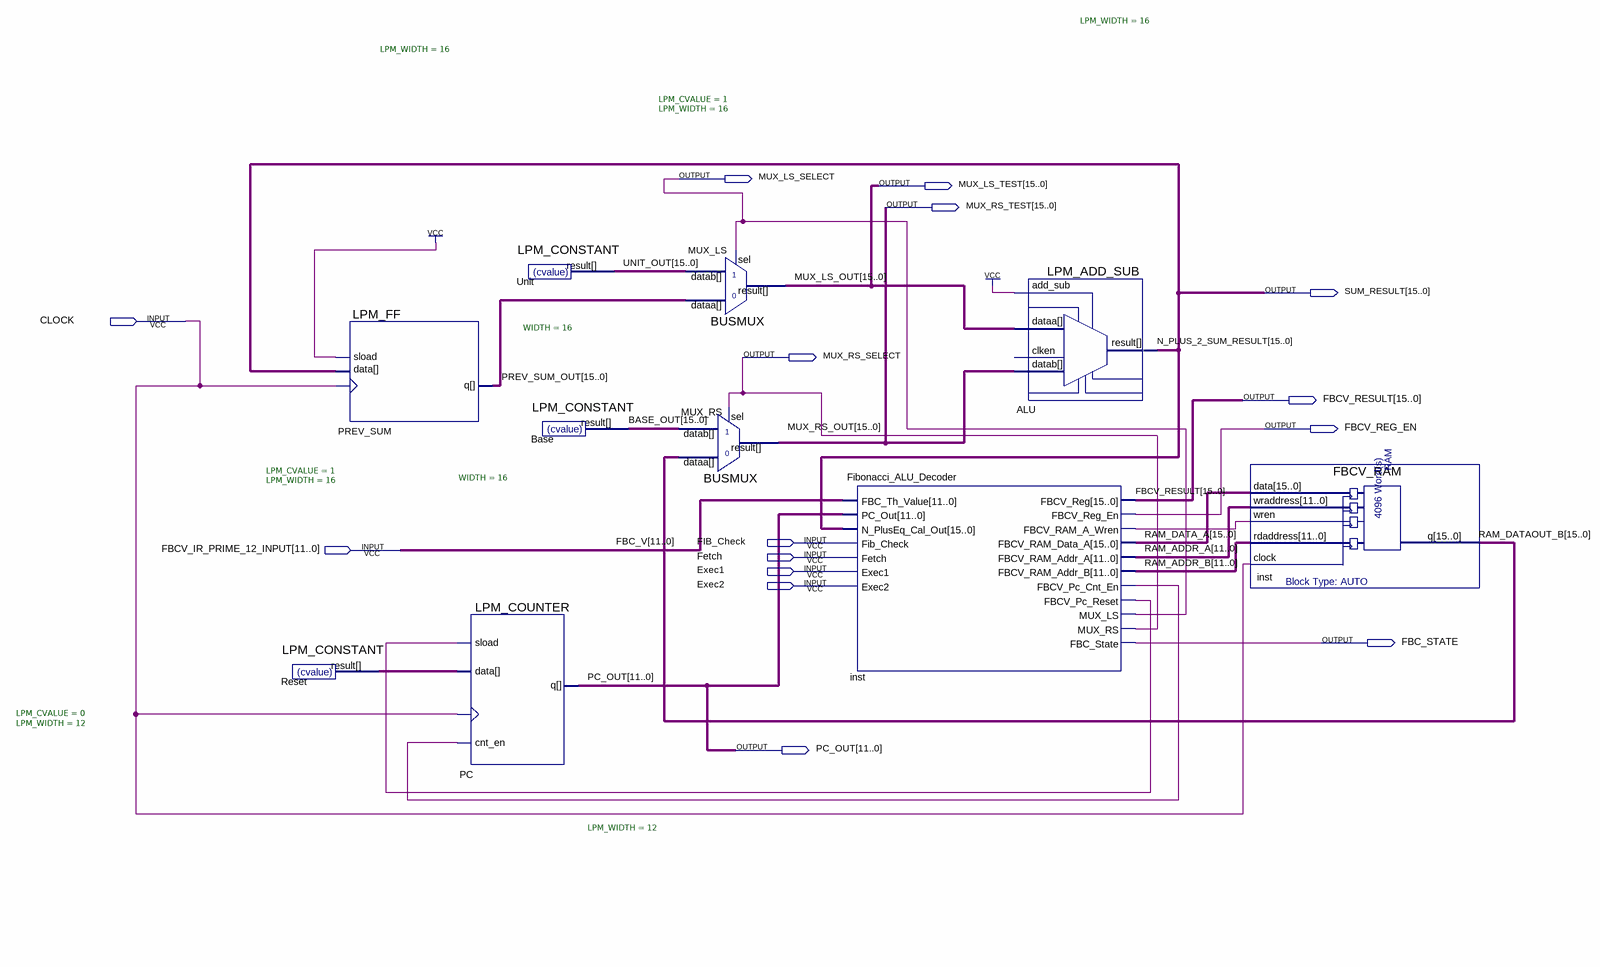
[diagram p0: schematic sheet]
// Quartus schematic Project_V1.bdf as structural Verilog: 10 symbols, 15 pins
module Project_V1 (
  input  CLOCK,
  input  FIB_Check,
  input  [11:0] FBCV_IR_PRIME_12_INPUT,
  input  Fetch,
  input  Exec1,
  input  Exec2,
  output MUX_LS_SELECT,
  output [15:0] MUX_LS_TEST,
  output [15:0] MUX_RS_TEST,
  output [15:0] SUM_RESULT,
  output MUX_RS_SELECT,
  output [15:0] FBCV_RESULT,
  output FBCV_REG_EN,
  output FBC_STATE,
  output [11:0] PC_OUT
);

  wire inst_fbcv_pc_cnt_en, inst_fbcv_pc_reset, inst_fbcv_ram_a_wren;
  wire [11:0] RAM_ADDR_A, RAM_ADDR_B, Reset_result;
  wire [15:0] BASE_OUT, PREV_SUM_OUT, RAM_DATA_A, RAM_DATAOUT_B, UNIT_OUT;

  LPM_CONSTANT #(.LPM_CVALUE(0), .LPM_WIDTH(12)) Reset (.result(Reset_result));
  LPM_FF #(.LPM_WIDTH(16)) PREV_SUM (.clock(CLOCK), .data(SUM_RESULT), .sload(1'b1), .q(PREV_SUM_OUT));
  LPM_COUNTER #(.LPM_WIDTH(12)) PC (
    .clock(CLOCK), .cnt_en(inst_fbcv_pc_cnt_en), .data(Reset_result), .sload(inst_fbcv_pc_reset), .q(PC_OUT));
  LPM_CONSTANT #(.LPM_CVALUE(1), .LPM_WIDTH(16)) Unit (.result(UNIT_OUT));
  LPM_CONSTANT #(.LPM_CVALUE(1), .LPM_WIDTH(16)) Base (.result(BASE_OUT));
  BUSMUX #(.WIDTH(16)) MUX_LS (.datab(UNIT_OUT), .sel(MUX_LS_SELECT), .dataa(PREV_SUM_OUT), .result(MUX_LS_TEST));
  BUSMUX #(.WIDTH(16)) MUX_RS (.datab(BASE_OUT), .sel(MUX_RS_SELECT), .dataa(RAM_DATAOUT_B), .result(MUX_RS_TEST));
  Fibonacci_ALU_Decoder inst (
    .FBC_Th_Value(FBCV_IR_PRIME_12_INPUT), .PC_Out(PC_OUT), .N_PlusEq_Cal_Out(SUM_RESULT),
    .Fib_Check(FIB_Check), .Fetch(Fetch), .Exec1(Exec1), .Exec2(Exec2), .FBCV_Reg(FBCV_RESULT),
    .FBCV_Reg_En(FBCV_REG_EN), .FBCV_RAM_A_Wren(inst_fbcv_ram_a_wren), .FBCV_RAM_Data_A(RAM_DATA_A),
    .FBCV_RAM_Addr_A(RAM_ADDR_A), .FBCV_RAM_Addr_B(RAM_ADDR_B), .FBCV_Pc_Cnt_En(inst_fbcv_pc_cnt_en),
    .FBCV_Pc_Reset(inst_fbcv_pc_reset), .MUX_LS(MUX_LS_SELECT), .MUX_RS(MUX_RS_SELECT), .FBC_State(FBC_STATE));
  LPM_ADD_SUB #(.LPM_WIDTH(16)) ALU (
    .add_sub(1'b1), .dataa(MUX_LS_TEST), .datab(MUX_RS_TEST), .result(SUM_RESULT));  // open: clken
  FBCV_RAM inst_dup2 (
    .data(RAM_DATA_A), .wraddress(RAM_ADDR_A), .wren(inst_fbcv_ram_a_wren), .rdaddress(RAM_ADDR_B),
    .clock(CLOCK), .q(RAM_DATAOUT_B));

  // Other names for the same wires on the sheet: FBC_V[11:0] = FBCV_IR_PRIME_12_INPUT; MUX_LS_OUT[15:0] = MUX_LS_TEST;
  //   MUX_RS_OUT[15:0] = MUX_RS_TEST; N_PLUS_2_SUM_RESULT[15:0] = SUM_RESULT
endmodule
